# Altium schematic sheet Sensors.SchDoc
size 423 x 119 mm; SheetNumber: 4; SheetTotal: 8
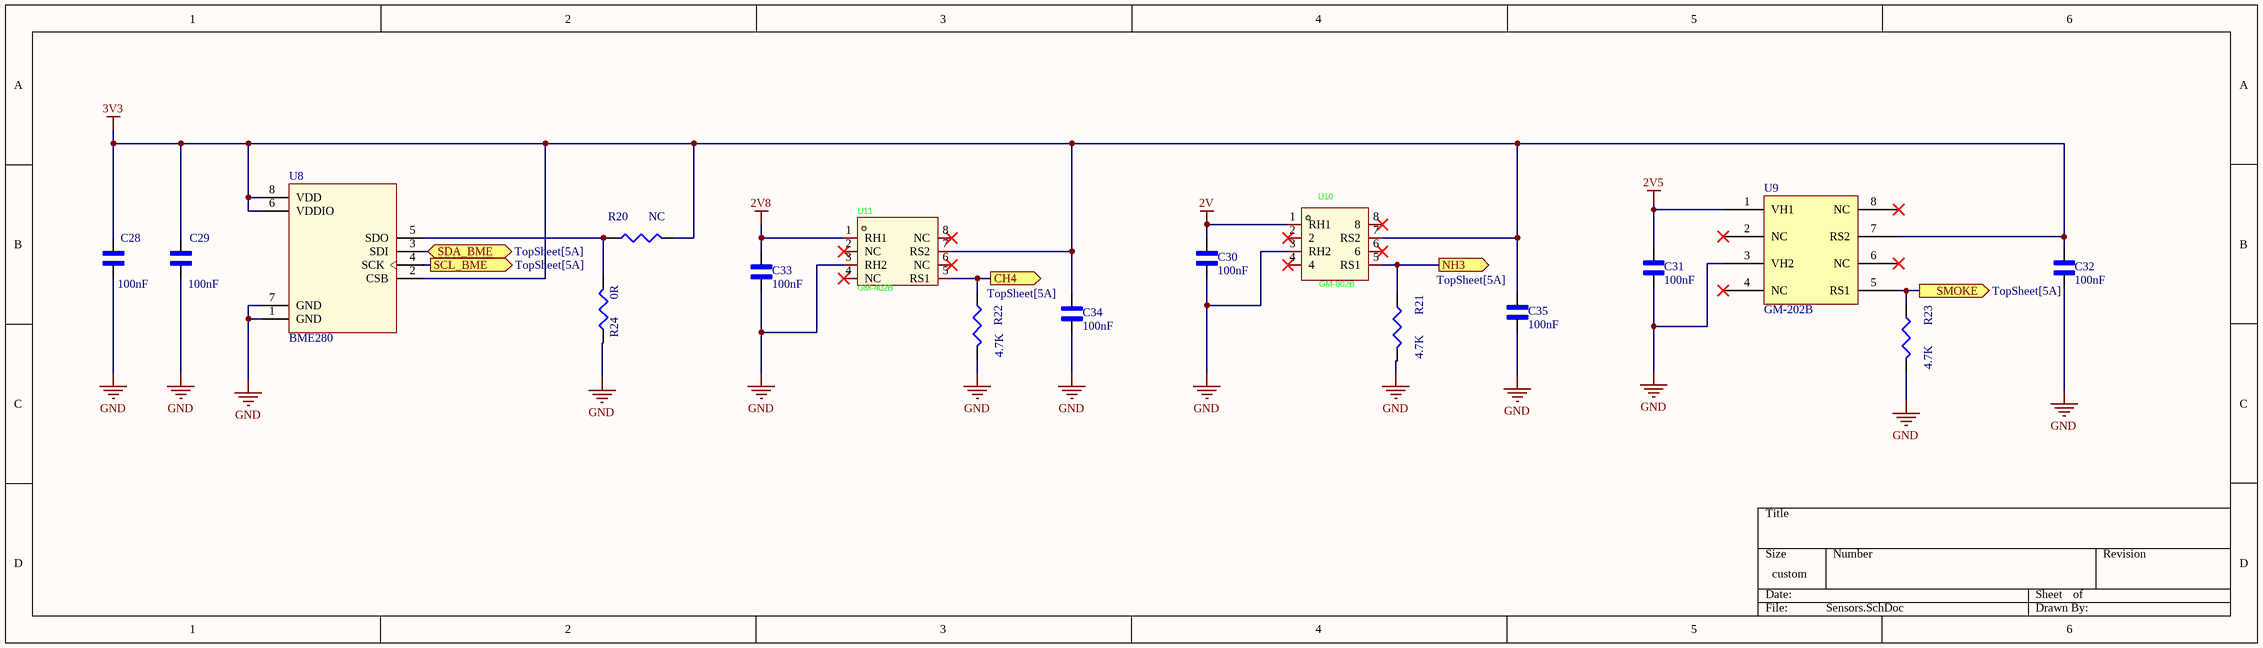
[diagram p0: Sensors.SchDoc]

## Parts
C28  100nF  [C0603]
C29  100nF  [C0603]
C30  100nF  [C0603]
C31  100nF  [C0603]
C32  100nF  [C0603]
C33  100nF  [C0603]
C34  100nF  [C0603]
C35  100nF  [C0603]
R20  NC  [R0603]
R21  4.7K  [R0603]
R22  4.7K  [R0603]
R23  4.7K  [R0603]
R24  0R  [R0603]
U8  BME280  [PSON65P250X250X100-8N]
U9  GM-202B  [LCC-8_L5.0-W5.0-P1.27-BL]
U10  GM-802B  [LCC-8_L5.0-W5.0-P1.27-BL]
U11  GM-402B  [SENSORS-SMD_GM-402B]

## Ports
CH4 (out, see TopSheet[5A]), NH3 (out, see TopSheet[5A]), SCL_BME (out, see TopSheet[5A]), SDA_BME (bidir, see TopSheet[5A]), SMOKE (out, see TopSheet[5A])

## Nets
2V: C30.2 U10.1(RH1)
2V5: C31.2 U9.1(VH1)
2V8: C33.2 U11.1(RH1)
3V3: C28.2 C29.2 C32.2 C34.2 C35.2 R20.2 U8.2(CSB) U8.6(VDDIO) U8.8(VDD) U9.7(RS2) U10.7(RS2) U11.7(RS2)
GND: C28.1 C29.1 C30.1 C31.1 C32.1 C33.1 C34.1 C35.1 R21.2 R22.2 R23.2 R24.1 U8.1(GND) U8.7(GND) U9.3(VH2) U10.3(RH2) U11.3(RH2)
CH4: R22.1 U11.5(RS1) ; port CH4
NH3: R21.1 U10.5(RS1) ; port NH3
SCL_BME: U8.4(SCK) ; port SCL_BME
SDA_BME: U8.3(SDI) ; port SDA_BME
SMOKE: R23.1 U9.5(RS1) ; port SMOKE
NetR20_1: R20.1 R24.2 U8.5(SDO)

Not connected (* = marked no-connect by the designer): U9 2(NC)* 4(NC)* 6(NC)* 8(NC)*; U10 2* 4* 6* 8*; U11 2(NC)* 4(NC)* 6(NC)* 8(NC)*

## Library data of the parts
C28-C35 = Capacitor non polar: This Non-Polarized Capacitor Design Library provides accurate schematic symbols and IPC-compliant PCB footprints for standard non-polarized capacitors, including MLCCs (ceramic capacitors) in common SMD sizes like 0402, 0603, 0805,1206 and 1210.; MF: Murata; MP: GJM1555C1HR10BB01J; SnapEDA_Link: https://www.snapeda.com/parts/GJM1555C1HR10BB01J/Murata/view-part/?ref=snap; Package: 1005 Taiyo Yuden; VALUE: 100nF; Check_prices: https://www.snapeda.com/parts/GJM1555C1HR10BB01J/Murata/view-part/?ref=eda
R20-R24 = Resistor: This Library provides a comprehensive set of schematic symbols and PCB footprints for standard resistor packages (e.g., 0402, 0603, 0805, 1206).
U8 = BME280: DIGITAL HUMIDITY, PRESSURE AND TEMPERATURE SENSOR<br>* Digital interface IÂ²C (up to 3.4 MHz) and SPI (3 and 4 wire, up to 10 MHz)* Supply voltage VDD main supply voltage range: 1.71 V to 3.6 V*VDDIO interface voltage range: 1.2 V to 3.6 V<br> Operating range -40â€¦+85 Â°C, 0â€¦100 % rel. humidity, 300â€¦1100 hPa <br><br>  The library has been designed by<a href="https://www.facebook.com/groups/eaglecadsoftUK"> Richard Magdycz</a>; Package: None; Availability: Unavailable; MP: BME280; Value: *; Price: None
U9 = GM-202B: Smoke Sensor winson
U10 = GM-802B_1: Pin Configuration: / Winsen Electronics / Pin 1 (RH1): Heater terminal 1 / winsen-sensor.com / Pin 2: Not connected / Pin 3 (RH2): Heater terminal 2 / Pin 4: Not connected / Winsen Electronics / Pin 5 (RS1): Sensor output terminal 1 (signal) / Pin 6: Not connected / Pin 7 (RS2): Sensor output terminal 2 (signal) / Pin 8: Not connected; Add into BOM: yes; Symbol: GM-802B; Device: GM-802B; LCSC Part Name: GM-802B; Supplier Part: C9900008830; Manufacturer Part: GM-802B; Supplier Footprint: LCC-8_L5.0-W5.0-P1.27; JLCPCB Part Class: Extended Part; Supplier: LCSC; Convert to PCB: yes
U11 = GM-402B: The GM-402B is a compact MEMS-based combustible gas sensor by Winsen Electronics, designed to detect gases like methane (CH₄) and propane (C₃H₈) within a 1–10,000 ppm range. The sensor features an 8-pin SMD package with the following; Manufacturer: Winsen(炜盛); Add into BOM: yes; Symbol: GM-402B; Device: GM-402B; LCSC Part Name: 可燃气体传感器; Supplier Part: C99754; Manufacturer Part: GM-402B; Supplier Footprint: SMD-8P,5x5mm; JLCPCB Part Class: Extended Part; Datasheet: https://atta.szlcsc.com/upload/public/pdf/source/20170413/1492062922238.pdf; Supplier: LCSC; Convert to PCB: yes